# Altium project RTM_SFP.PrjPcb (part 2 of 2)

## Sheet Serial_Registers.SchDoc: Serial Registers
size 420 x 297 mm; Organization: Altium Limited; Address1: L3, 12a Rodborough Rd; Address2: Frenchs Forest; Address3: NSW; Address4: Australia 2086; SheetNumber: 6; SheetTotal: 8
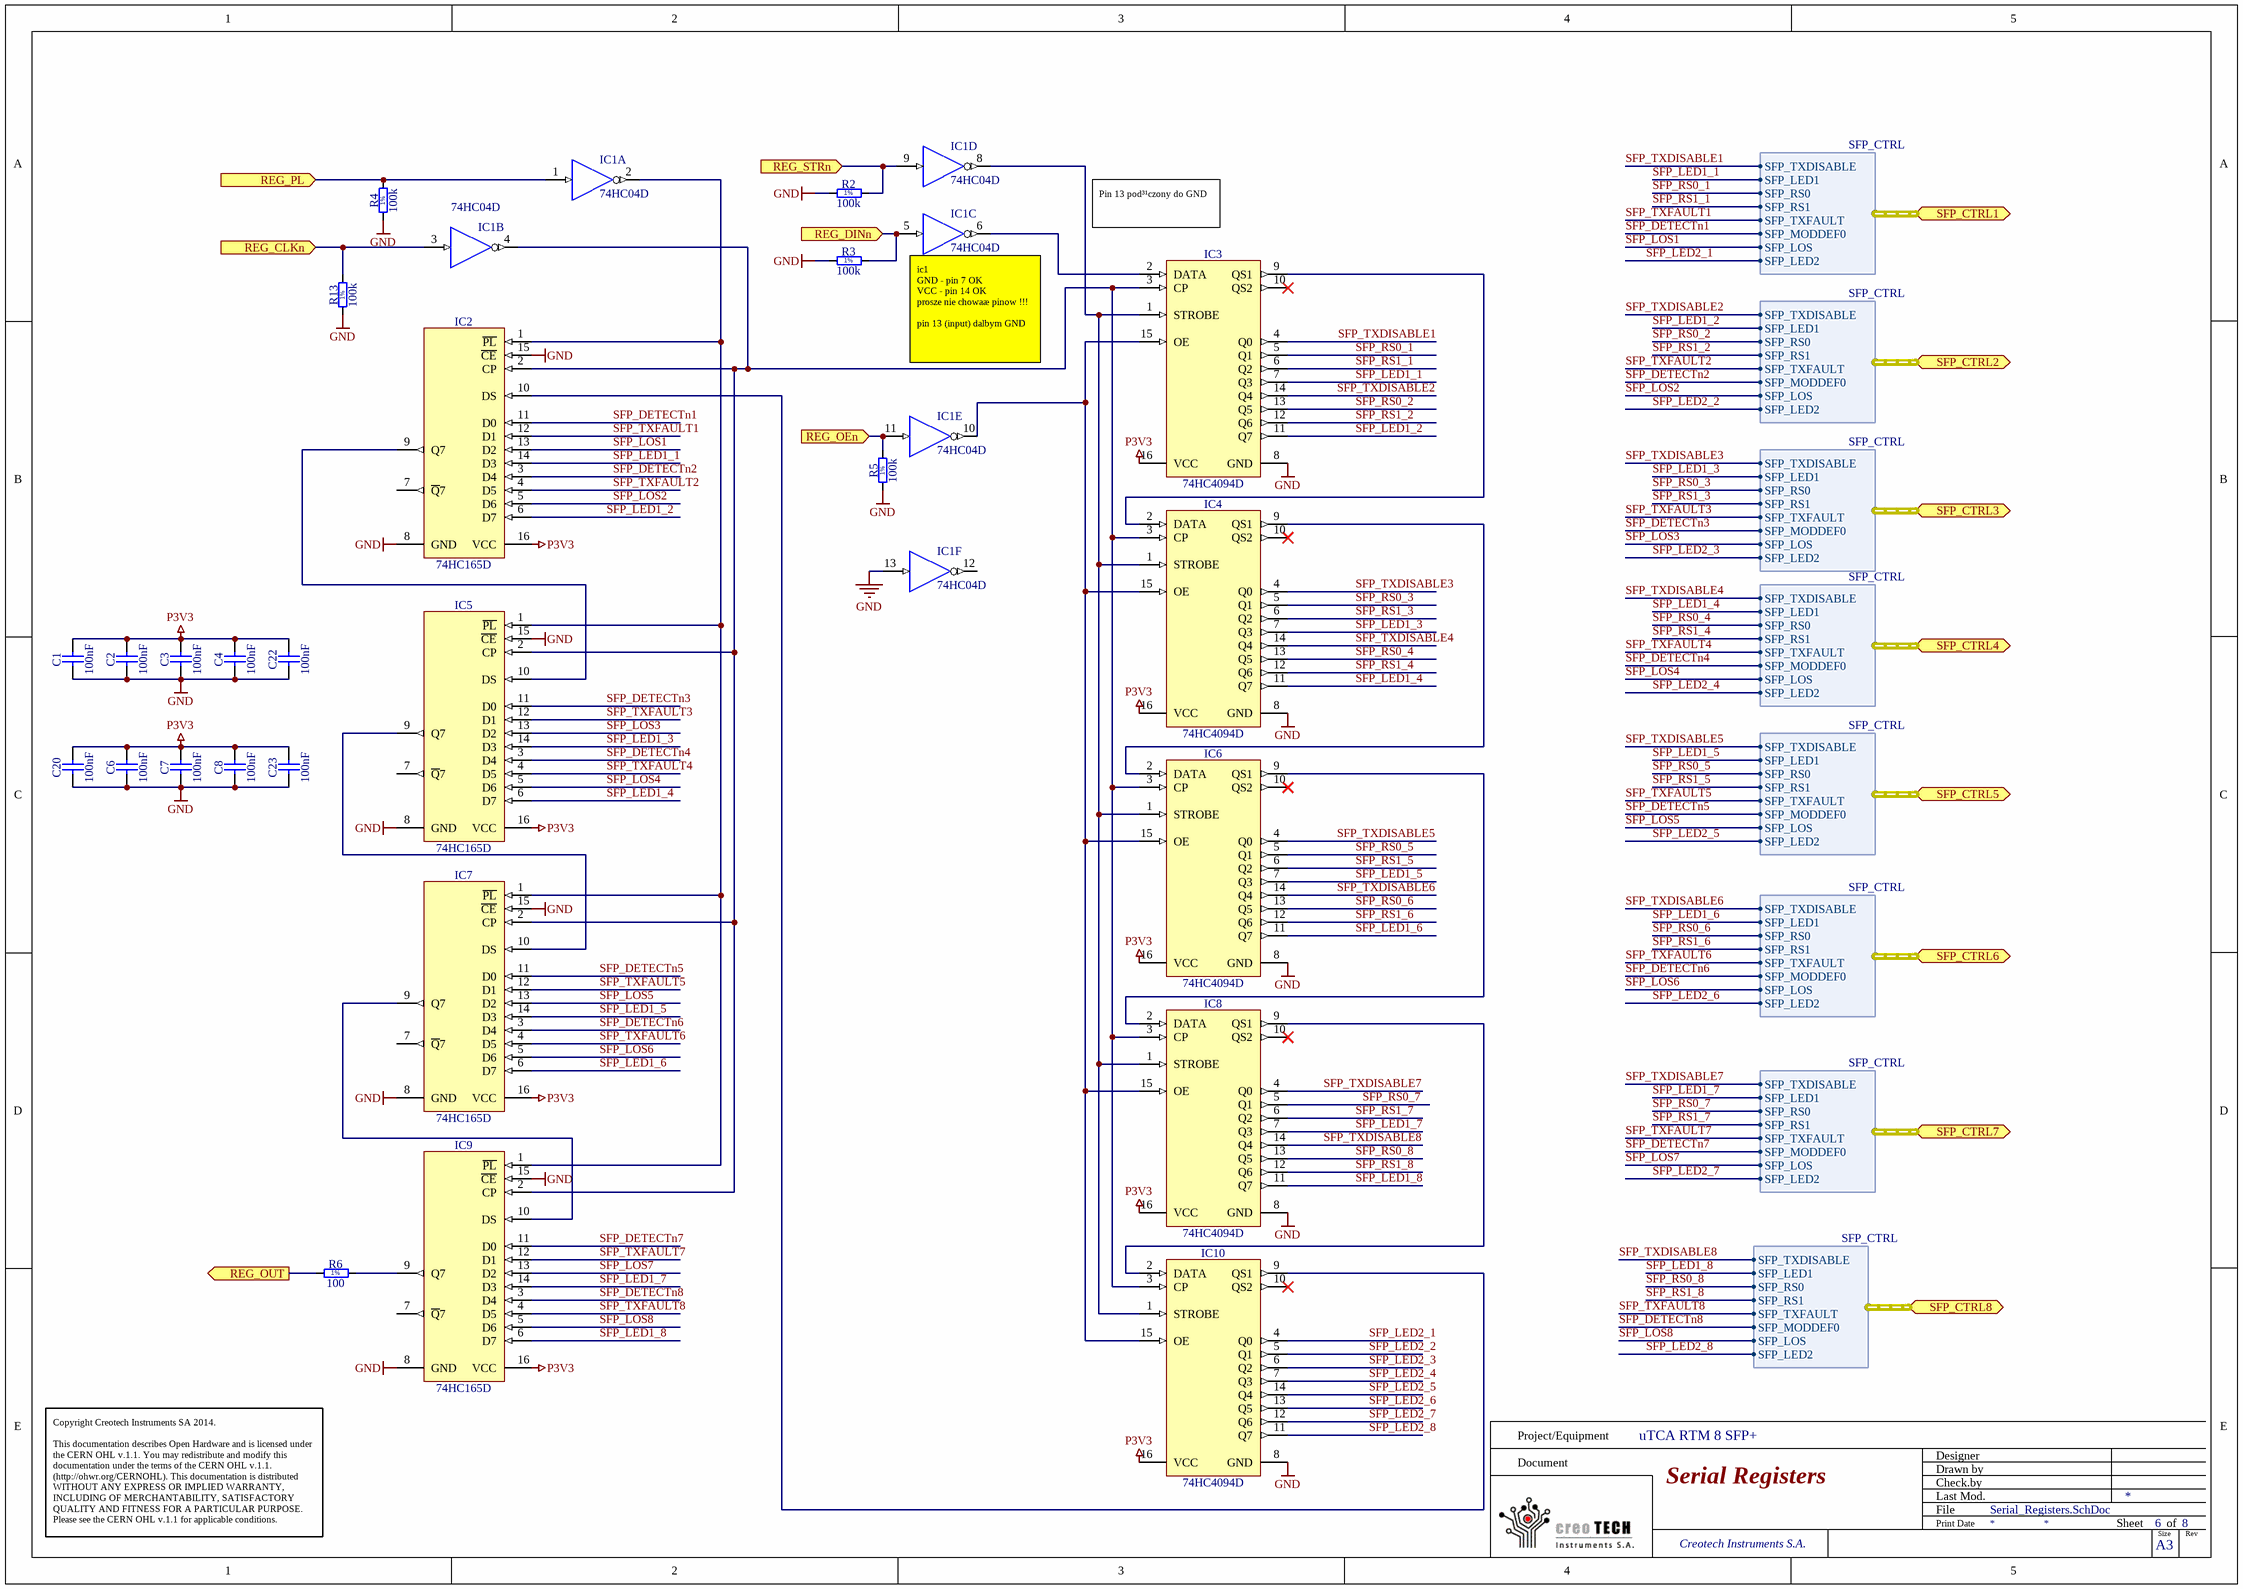
[diagram p4: Serial_Registers.SchDoc]

### Parts
C1  100nF  [CAPC1005X55N]
C2  100nF  [CAPC1005X55N]
C3  100nF  [CAPC1005X55N]
C4  100nF  [CAPC1005X55N]
C6  100nF  [CAPC1005X55N]
C7  100nF  [CAPC1005X55N]
C8  100nF  [CAPC1005X55N]
C20  100nF  [CAPC1005X55N]
C22  100nF  [CAPC1005X55N]
C23  100nF  [CAPC1005X55N]
IC1  74HC04D  [SOIC127P600X175-14N]  (parts A,B,C,D,E,F of 6)
IC2  74HC165D  [SOIC127P600X175-16N]
IC3  74HC4094D  [SOIC127P1000X400-16N]
IC4  74HC4094D  [SOIC127P1000X400-16N]
IC5  74HC165D  [SOIC127P600X175-16N]
IC6  74HC4094D  [SOIC127P1000X400-16N]
IC7  74HC165D  [SOIC127P600X175-16N]
IC8  74HC4094D  [SOIC127P1000X400-16N]
IC9  74HC165D  [SOIC127P600X175-16N]
IC10  74HC4094D  [SOIC127P1000X400-16N]
R2  100k  [RESC1608X55N]
R3  100k  [RESC1608X55N]
R4  100k  [RESC1608X55N]
R5  100k  [RESC1608X55N]
R6  100  [RESC1608X55N]
R13  100k  [RESC1608X55N]

### Ports
REG_CLKn (in), REG_DINn (in), REG_OEn (in), REG_OUT (out), REG_PL (in), REG_STRn (in), SFP_CTRL1 (harness SFP_CTRL), SFP_CTRL2 (harness SFP_CTRL), SFP_CTRL3 (harness SFP_CTRL), SFP_CTRL4 (harness SFP_CTRL), SFP_CTRL5 (harness SFP_CTRL), SFP_CTRL6 (harness SFP_CTRL), SFP_CTRL7 (harness SFP_CTRL), SFP_CTRL8 (harness SFP_CTRL)

### Harnesses
SFP_CTRL: SFP_LED1, SFP_TXFAULT, SFP_TXDISABLE, SFP_MODDEF0, SFP_RS0, SFP_RS1, SFP_LOS, SFP_LED2

### Nets
GND: C1.2 C2.2 C3.2 C4.2 C6.2 C7.2 C8.2 C20.2 C22.2 C23.2 IC1.7(GND) IC1.13(A) IC2.8(GND) IC2.15(~{CE}) IC3.8(GND) IC4.8(GND) IC5.8(GND) IC5.15(~{CE}) IC6.8(GND) IC7.8(GND) IC7.15(~{CE}) IC8.8(GND) IC9.8(GND) IC9.15(~{CE}) IC10.8(GND) R2.1 R3.1 R4.1 R5.1 R13.1
P3V3: C1.1 C2.1 C3.1 C4.1 C6.1 C7.1 C8.1 C20.1 C22.1 C23.1 IC1.14(VCC) IC2.16(VCC) IC3.16(VCC) IC4.16(VCC) IC5.16(VCC) IC6.16(VCC) IC7.16(VCC) IC8.16(VCC) IC9.16(VCC) IC10.16(VCC)
RTM_IO1: R6.1 ; port REG_OUT
RTM_IO2: IC1.11(A) R5.2 ; port REG_OEn
RTM_IO3: IC1.3(A) R13.2 ; port REG_CLKn
RTM_IO4: IC1.9(A) R2.2 ; port REG_STRn
RTM_IO5: IC1.5(A) R3.2 ; port REG_DINn
RTM_IO6: IC1.1(A) R4.2 ; port REG_PL
SFP_DETECTn1: IC2.11(D0) ; port SFP_CTRL1.SFP_MODDEF0
SFP_DETECTn2: IC2.3(D4) ; port SFP_CTRL2.SFP_MODDEF0
SFP_DETECTn3: IC5.11(D0) ; port SFP_CTRL3.SFP_MODDEF0
SFP_DETECTn4: IC5.3(D4) ; port SFP_CTRL4.SFP_MODDEF0
SFP_DETECTn5: IC7.11(D0) ; port SFP_CTRL5.SFP_MODDEF0
SFP_DETECTn6: IC7.3(D4) ; port SFP_CTRL6.SFP_MODDEF0
SFP_DETECTn7: IC9.11(D0) ; port SFP_CTRL7.SFP_MODDEF0
SFP_DETECTn8: IC9.3(D4) ; port SFP_CTRL8.SFP_MODDEF0
SFP_LED1_1: IC2.14(D3) IC3.7(Q3) ; port SFP_CTRL1.SFP_LED1
SFP_LED1_2: IC2.6(D7) IC3.11(Q7) ; port SFP_CTRL2.SFP_LED1
SFP_LED1_3: IC4.7(Q3) IC5.14(D3) ; port SFP_CTRL3.SFP_LED1
SFP_LED1_4: IC4.11(Q7) IC5.6(D7) ; port SFP_CTRL4.SFP_LED1
SFP_LED1_5: IC6.7(Q3) IC7.14(D3) ; port SFP_CTRL5.SFP_LED1
SFP_LED1_6: IC6.11(Q7) IC7.6(D7) ; port SFP_CTRL6.SFP_LED1
SFP_LED1_7: IC8.7(Q3) IC9.14(D3) ; port SFP_CTRL7.SFP_LED1
SFP_LED1_8: IC8.11(Q7) IC9.6(D7) ; port SFP_CTRL8.SFP_LED1
SFP_LED2_1: IC10.4(Q0) ; port SFP_CTRL1.SFP_LED2
SFP_LED2_2: IC10.5(Q1) ; port SFP_CTRL2.SFP_LED2
SFP_LED2_3: IC10.6(Q2) ; port SFP_CTRL3.SFP_LED2
SFP_LED2_4: IC10.7(Q3) ; port SFP_CTRL4.SFP_LED2
SFP_LED2_5: IC10.14(Q4) ; port SFP_CTRL5.SFP_LED2
SFP_LED2_6: IC10.13(Q5) ; port SFP_CTRL6.SFP_LED2
SFP_LED2_7: IC10.12(Q6) ; port SFP_CTRL7.SFP_LED2
SFP_LED2_8: IC10.11(Q7) ; port SFP_CTRL8.SFP_LED2
SFP_LOS1: IC2.13(D2) ; port SFP_CTRL1.SFP_LOS
SFP_LOS2: IC2.5(D6) ; port SFP_CTRL2.SFP_LOS
SFP_LOS3: IC5.13(D2) ; port SFP_CTRL3.SFP_LOS
SFP_LOS4: IC5.5(D6) ; port SFP_CTRL4.SFP_LOS
SFP_LOS5: IC7.13(D2) ; port SFP_CTRL5.SFP_LOS
SFP_LOS6: IC7.5(D6) ; port SFP_CTRL6.SFP_LOS
SFP_LOS7: IC9.13(D2) ; port SFP_CTRL7.SFP_LOS
SFP_LOS8: IC9.5(D6) ; port SFP_CTRL8.SFP_LOS
SFP_RS0_1: IC3.5(Q1) ; port SFP_CTRL1.SFP_RS0
SFP_RS0_2: IC3.13(Q5) ; port SFP_CTRL2.SFP_RS0
SFP_RS0_3: IC4.5(Q1) ; port SFP_CTRL3.SFP_RS0
SFP_RS0_4: IC4.13(Q5) ; port SFP_CTRL4.SFP_RS0
SFP_RS0_5: IC6.5(Q1) ; port SFP_CTRL5.SFP_RS0
SFP_RS0_6: IC6.13(Q5) ; port SFP_CTRL6.SFP_RS0
SFP_RS0_7: IC8.5(Q1) ; port SFP_CTRL7.SFP_RS0
SFP_RS0_8: IC8.13(Q5) ; port SFP_CTRL8.SFP_RS0
SFP_RS1_1: IC3.6(Q2) ; port SFP_CTRL1.SFP_RS1
SFP_RS1_2: IC3.12(Q6) ; port SFP_CTRL2.SFP_RS1
SFP_RS1_3: IC4.6(Q2) ; port SFP_CTRL3.SFP_RS1
SFP_RS1_4: IC4.12(Q6) ; port SFP_CTRL4.SFP_RS1
SFP_RS1_5: IC6.6(Q2) ; port SFP_CTRL5.SFP_RS1
SFP_RS1_6: IC6.12(Q6) ; port SFP_CTRL6.SFP_RS1
SFP_RS1_7: IC8.6(Q2) ; port SFP_CTRL7.SFP_RS1
SFP_RS1_8: IC8.12(Q6) ; port SFP_CTRL8.SFP_RS1
SFP_TXDISABLE1: IC3.4(Q0) ; port SFP_CTRL1.SFP_TXDISABLE
SFP_TXDISABLE2: IC3.14(Q4) ; port SFP_CTRL2.SFP_TXDISABLE
SFP_TXDISABLE3: IC4.4(Q0) ; port SFP_CTRL3.SFP_TXDISABLE
SFP_TXDISABLE4: IC4.14(Q4) ; port SFP_CTRL4.SFP_TXDISABLE
SFP_TXDISABLE5: IC6.4(Q0) ; port SFP_CTRL5.SFP_TXDISABLE
SFP_TXDISABLE6: IC6.14(Q4) ; port SFP_CTRL6.SFP_TXDISABLE
SFP_TXDISABLE7: IC8.4(Q0) ; port SFP_CTRL7.SFP_TXDISABLE
SFP_TXDISABLE8: IC8.14(Q4) ; port SFP_CTRL8.SFP_TXDISABLE
SFP_TXFAULT1: IC2.12(D1) ; port SFP_CTRL1.SFP_TXFAULT
SFP_TXFAULT2: IC2.4(D5) ; port SFP_CTRL2.SFP_TXFAULT
SFP_TXFAULT3: IC5.12(D1) ; port SFP_CTRL3.SFP_TXFAULT
SFP_TXFAULT4: IC5.4(D5) ; port SFP_CTRL4.SFP_TXFAULT
SFP_TXFAULT5: IC7.12(D1) ; port SFP_CTRL5.SFP_TXFAULT
SFP_TXFAULT6: IC7.4(D5) ; port SFP_CTRL6.SFP_TXFAULT
SFP_TXFAULT7: IC9.12(D1) ; port SFP_CTRL7.SFP_TXFAULT
SFP_TXFAULT8: IC9.4(D5) ; port SFP_CTRL8.SFP_TXFAULT
NetIC1_2: IC1.2(~{O}) IC2.1(~{PL}) IC5.1(~{PL}) IC7.1(~{PL}) IC9.1(~{PL})
NetIC1_4: IC1.4(~{O}) IC2.2(CP) IC3.3(CP) IC4.3(CP) IC5.2(CP) IC6.3(CP) IC7.2(CP) IC8.3(CP) IC9.2(CP) IC10.3(CP)
NetIC1_6: IC1.6(~{O}) IC3.2(DATA)
NetIC1_8: IC1.8(~{O}) IC3.1(STROBE) IC4.1(STROBE) IC6.1(STROBE) IC8.1(STROBE) IC10.1(STROBE)
NetIC1_10: IC1.10(~{O}) IC3.15(OE) IC4.15(OE) IC6.15(OE) IC8.15(OE) IC10.15(OE)
NetIC2_9: IC2.9(Q7) IC5.10(DS)
NetIC2_10: IC2.10(DS) IC10.9(QS1)
NetIC3_9: IC3.9(QS1) IC4.2(DATA)
NetIC4_9: IC4.9(QS1) IC6.2(DATA)
NetIC5_9: IC5.9(Q7) IC7.10(DS)
NetIC6_9: IC6.9(QS1) IC8.2(DATA)
NetIC7_9: IC7.9(Q7) IC9.10(DS)
NetIC8_9: IC8.9(QS1) IC10.2(DATA)
NetIC9_9: IC9.9(Q7) R6.2

Not connected (* = marked no-connect by the designer): IC1 12(~{O}); IC2 7(~{Q}7); IC3 10(QS2)*; IC4 10(QS2)*; IC5 7(~{Q}7); IC6 10(QS2)*; IC7 7(~{Q}7); IC8 10(QS2)*; IC9 7(~{Q}7); IC10 10(QS2)*

### Notes on the sheet
- (near IC3) Pin 13 pod³¹czony do GND
- (near IC1) ic1
  GND - pin 7 OK
  VCC - pin 14 OK
  prosze nie chowaæ pinow !!!
  pin 13 (input) dalbym GND
- Project/Equipment
- Document
- uTCA RTM 8 SFP+
- Designer
- Drawn by
- Check.by
- Copyright Creotech Instruments SA 2014.
  This documentation describes Open Hardware and is licensed under the CERN OHL v.1.1. You may redistribute and modify this documentation under the terms of the CERN OHL v.1.1. (http://ohwr.org/CERNOHL). This documentation is distributed WITHOUT ANY EXPRESS OR IMPLIED WARRANTY, INCLUDING OF MERCHANTABILITY, SATISFACTORY QUALITY AND FITNESS FOR A PARTICULAR PURPOSE. Please see the CERN OHL v.1.1 for applicable conditions.
- Creotech Instruments S.A.
- File
- Last Mod.
- Print Date
- Sheet
- Size
- A3
- of
- Rev
- (in symbol R0603_100K_1%_0.1W_100PPM) 1%
- (in symbol R0603_100R_1%_0.1W_100PPM) 1%

### Library data of the parts
C1-C4 C6-C8 C20 C22 C23 = CC0402_100NF_16V_10%_X7R: Non-polarised capacitor; Part Description: SMD Multilayer Chip Ceramic Capacitor; Manufacturer: GENERIC; Manufacturer1 Part Number: 223878715649; Voltage: 16V; TC: X7R; Tolerance: ±10%; Table: Capacitors SMD; Part Number: CC0402_100NF_16V_10%_X7R; Component Kind: Standard; Component Type: Standard; Pin Count: 2; Value: 100nF; Status: Not Recommended; Manufacturer Part Number: CC0402_100NF_16V_10%_X7R; Case: 0402; Mounted: Yes; Socket: No; SMD: Yes; Manufacturer1 Example: PHYCOMP; Manufacturer1 ComponentHeight: 0.55mm; HelpURL: \\cern.ch\dfs\Applications\Altium\Datasheets\CC0402_X7R_PHYCOMP.pdf; Author: CERN DEM JLC; CreateDate: 12/3/2007; LatestRevisionDate: 12/3/2007
IC1 = 74HC04D: Hex Inverter; Part Description: Hex Inverters; Manufacturer: NXP SEMICONDUCTORS; Table: Standard Logic; Part Number: 74HC04D; Component Kind: Standard; Component Type: Standard; Device: 74HC04D; PackageDescription: SOIC 14, Pitch 1.27mm - Body 4x8.75mm, IPC Medium Density; Manufacturer Part Number: 74HC04D; Pin Count: 12; Case: SOIC14; Mounted: Yes; Socket: No; SMD: Yes; ComponentHeight: 1.75mm; Author: CERN DEM JLC; HelpURL: \\cern.ch\dfs\Applications\Altium\Datasheets\74HC04D.pdf; CreateDate: 2011-04-06; LatestRevisionDate: 2011-04-06
IC2 IC5 IC7 IC9 = 74HC165D: 8-Bit Parallel-In/Serial Out Shift Register; Manufacturer: NXP SEMICONDUCTORS; Table: Standard Logic; Part Number: 74HC165D; Component Kind: Standard; Component Type: Standard; Device: 74HC165D; PackageDescription: SOIC 16, Pitch 1.27mm - Body 4x10mm, IPC Medium Density; Part Description: 8-Bit Parallel-In/Serial Out Shift Register; Manufacturer Part Number: 74HC165D; Pin Count: 16; Case: SOIC16; Mounted: Yes; Socket: No; SMD: Yes; ComponentHeight: 1.75mm; Author: CERN DEM JLC; HelpURL: \\cern.ch\dfs\Applications\Altium\Datasheets\74HC165D.pdf; CreateDate: 2012-04-26; LatestRevisionDate: 2012-04-26
IC3 IC4 IC6 IC8 IC10 = 74HC4094D: High−Speed CMOS Logic, 8−Stage Shift and Store Bus Register, Three−State; Manufacturer: NXP; PressFit: No; Bonding: No; Part Number: 74HC4094D; Component Kind: Standard; Component Type: Standard; Device: 74HC4094D; PackageDescription: SOIC 16, Pitch 1.27mm - Body 4x10mm, IPC Medium Density; Part Description: High−Speed CMOS Logic, 8−Stage Shift and Store Bus Register, Three−State; Manufacturer Part Number: 74HC4094D; Pin Count: 16; Case: SOIC16; Mounted: Yes; Socket: No; SMD: Yes; Sense: No; ComponentHeight: 1.75mm; Author: LNLS DIG LOS; CreateDate: 27/01/2017; LatestRevisionDate: 27/01/2017
R2-R5 R13 = R0603_100K_1%_0.1W_100PPM: Resistor - 1%; Part Description: General Purpose Thick Film Chip Resistor; Manufacturer: GENERIC; Manufacturer1 Part Number: NRC06F1003TRF; Power: 0.1W; TC: ±100ppm/°C; Part Number: R0603_100K_1%_0.1W_100PPM; Component Kind: Standard; Component Type: Standard; Pin Count: 2; Value: 100k; Status: Preferred; Tolerance: ±1%; Manufacturer Part Number: R0603_100K_1%_0.1W_100PPM; Case: 0603; Mounted: Yes; Sense: No; Socket: No; SMD: Yes; Manufacturer1 Example: NIC COMPONENT; Manufacturer1 ComponentHeight: 0.55mm; HelpURL: \\cern.ch\dfs\Applications\Altium\Datasheets\R0603_NIC_NRC.pdf; Author: CERN DEM JLC; CreateDate: 03/12/2007; LatestRevisionDate: 13/03/2008
R6 = R0603_100R_1%_0.1W_100PPM: as R33 on sheet RTM_Connectors; Part Number: R0603_100R_1%_0.1W_100PPM; Component Kind: Standard; Component Type: Standard; Pin Count: 2; Value: 100; Status: Preferred; Tolerance: ±1%; Manufacturer Part Number: R0603_100R_1%_0.1W_100PPM; Case: 0603; Mounted: Yes; Sense: No; Socket: No; SMD: Yes; Manufacturer1 Example: NIC COMPONENT; Manufacturer1 ComponentHeight: 0.55mm; HelpURL: \\cern.ch\dfs\Applications\Altium\Datasheets\R0603_NIC_NRC.pdf; Author: CERN DEM JLC; CreateDate: 03/12/2007; LatestRevisionDate: 13/03/2008

## Sheet SFP.SchDoc: SFP
size 420 x 297 mm; Organization: Altium Limited; Address1: L3, 12a Rodborough Rd; Address2: Frenchs Forest; Address3: NSW; Address4: Australia 2086; SheetNumber: 7; SheetTotal: 8
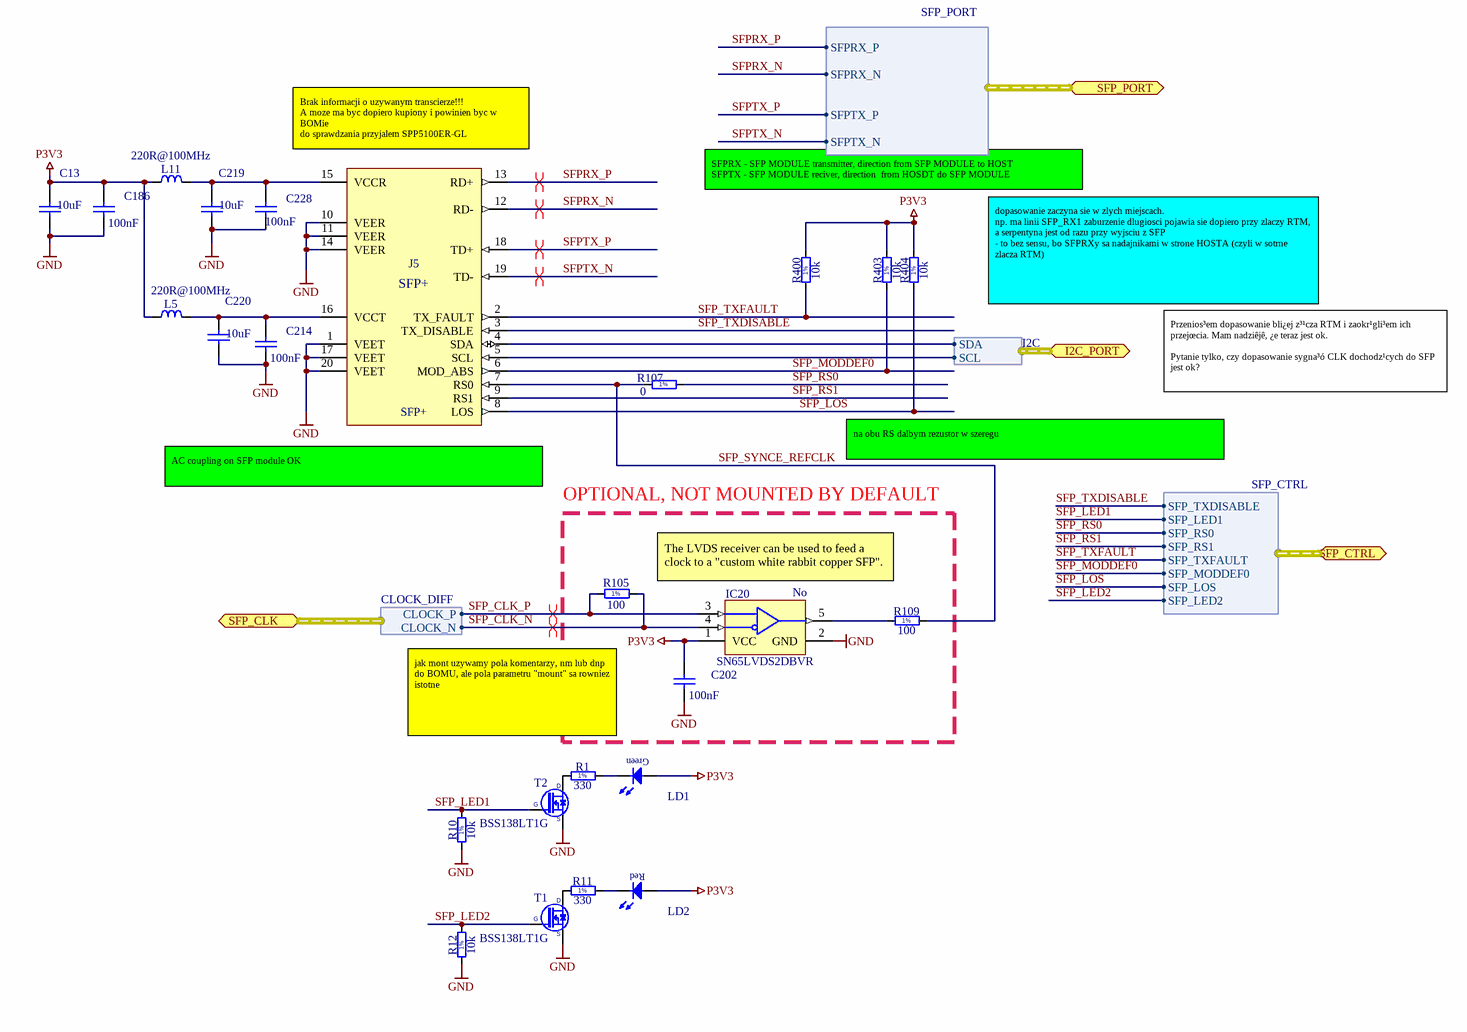
[diagram p5: SFP.SchDoc]

### Parts
C13  10uF  [CAPC2012X135N]
C186  100nF  [CAPC1005X55N]
C202  100nF  [CAPC1005X55N]
C214  100nF  [CAPC1005X55N]
C219  10uF  [CAPC2012X135N]
C220  10uF  [CAPC2012X135N]
C228  100nF  [CAPC1005X55N]
IC20  SN65LVDS2DBVR  Mounted: No  [SOT95P280X145-5N]
J5  SFP+  [TYCO_1888247-1]
L5  220R@100MHz  [INDC2012X105N]
L11  220R@100MHz  [INDC2012X105N]
LD1  Green  [LED_AVAGO_HSME-C120]  (value not drawn)
LD2  Red  [LED_AVAGO_HSMC-C120]  (value not drawn)
R1  330  [RESC1608X55N]
R10  10k  [RESC1005X40N]
R11  330  [RESC1608X55N]
R12  10k  [RESC1005X40N]
R105  100  [RESC1608X55N]
R107  0  [RESC1608X55N]
R109  100  [RESC1608X55N]
R400  10k  [RESC1005X40N]
R403  10k  [RESC1005X40N]
R404  10k  [RESC1005X40N]
T1  BSS138LT1G  [SOT95P240X110-3N]
T2  BSS138LT1G  [SOT95P240X110-3N]

### Blocks framed on the sheet
OPTIONAL, NOT MOUNTED BY DEFAULT: C202 IC20 R105 R109

### Ports
I2C_PORT (harness I2C), SFP_CLK (harness CLOCK_DIFF), SFP_CTRL (harness SFP_CTRL), SFP_PORT (harness SFP_PORT)

### Harnesses
I2C: SCL, SDA
CLOCK_DIFF: CLOCK_P, CLOCK_N
SFP_PORT: SFPRX_P, SFPRX_N, SFPTX_P, SFPTX_N
SFP_CTRL: SFP_LED1, SFP_TXFAULT, SFP_TXDISABLE, SFP_MODDEF0, SFP_RS0, SFP_RS1, SFP_LOS, SFP_LED2

### Nets
GND: C13.2 C186.2 C202.1 C214.2 C219.2 C220.2 C228.2 IC20.2(GND) J5.1(VEET) J5.10(VEER) J5.11(VEER) J5.14(VEER) J5.17(VEET) J5.20(VEET) R10.1 R12.1 T1.2(S) T2.2(S)
P3V3: C13.1 C186.1 C202.2 IC20.1(VCC) L5.1 L11.1 LD1.2(A) LD2.2(A) R400.2 R403.2 R404.2
SFP_CLK_N: IC20.4(B) R105.2 ; port SFP_CLK.CLOCK_N
SFP_CLK_P: IC20.3(A) R105.1 ; port SFP_CLK.CLOCK_P
SFP_LED1: R10.2 T2.1(G) ; port SFP_CTRL.SFP_LED1
SFP_LED2: R12.2 T1.1(G) ; port SFP_CTRL.SFP_LED2
SFP_LOS: J5.8(LOS) R404.1 ; port SFP_CTRL.SFP_LOS
SFP_MODDEF0: J5.6(MOD_ABS) R403.1 ; port SFP_CTRL.SFP_MODDEF0
SFP_RS0: R107.2 ; port SFP_CTRL.SFP_RS0
SFP_RS1: J5.9(RS1) ; port SFP_CTRL.SFP_RS1
SFP_SYNCE_REFCLK: J5.7(RS0) R107.1 R109.2
SFP_TXDISABLE: J5.3(TX_DISABLE) ; port SFP_CTRL.SFP_TXDISABLE
SFP_TXFAULT: J5.2(TX_FAULT) R400.1 ; port SFP_CTRL.SFP_TXFAULT
SFPRX_N: J5.12(RD-) ; port SFP_PORT.SFPRX_N
SFPRX_P: J5.13(RD+) ; port SFP_PORT.SFPRX_P
SFPTX_N: J5.19(TD-) ; port SFP_PORT.SFPTX_N
SFPTX_P: J5.18(TD+) ; port SFP_PORT.SFPTX_P
NetC214_1: C214.1 C220.1 J5.16(VCCT) L5.2
NetC219_1: C219.1 C228.1 J5.15(VCCR) L11.2
NetIC20_5: IC20.5(R) R109.1
NetJ5_4: J5.4(SDA) ; port I2C_PORT.SDA
NetJ5_5: J5.5(SCL) ; port I2C_PORT.SCL
NetLD1_1: LD1.1(C) R1.2
NetLD2_1: LD2.1(C) R11.2
NetR1_1: R1.1 T2.3(D)
NetR11_1: R11.1 T1.3(D)

### Layout directives
differential pair: SFP_CLK_N, SFP_CLK_P, SFPRX_N, SFPRX_P, SFPTX_N, SFPTX_P

### Notes on the sheet
- (near J5) Brak informacji o uzywanym transcierze!!!
  A moze ma byc dopiero kupiony i powinien byc w BOMie
  do sprawdzania przyjalem SPP5100ER-GL
- SFPRX - SFP MODULE transmitter, direction from SFP MODULE to HOST
  SFPTX - SFP MODULE reciver, direction  from HOSDT do SFP MODULE
- dopasowanie zaczyna sie w zlych miejscach.
  np. ma linii SFP_RX1 zaburzenie dlugiosci pojawia sie dopiero przy zlaczy RTM, a serpentyna jest od razu przy wyjsciu z SFP
  - to bez sensu, bo SFPRXy sa nadajnikami w strone HOSTA (czyli w sotrne zlacza RTM)
- Przenios³em dopasowanie bli¿ej z³¹cza RTM i zaokr¹gli³em ich przejœcia. Mam nadziêjê, ¿e teraz jest ok.
  Pytanie tylko, czy dopasowanie sygna³ó CLK dochodz¹cych do SFP jest ok?
- (near J5) AC coupling on SFP module OK
- na obu RS dalbym rezustor w szeregu
- The LVDS receiver can be used to feed a clock to a "custom white rabbit copper SFP".
- jak mont uzywamy pola komentarzy, nm lub dnp do BOMU, ale pola parametru "mount" sa rowniez istotne
- Project/Equipment
- Document
- uTCA RTM 8 SFP+
- Designer
- Drawn by
- Check.by
- Copyright Creotech Instruments SA 2014.
  This documentation describes Open Hardware and is licensed under the CERN OHL v.1.1. You may redistribute and modify this documentation under the terms of the CERN OHL v.1.1. (http://ohwr.org/CERNOHL). This documentation is distributed WITHOUT ANY EXPRESS OR IMPLIED WARRANTY, INCLUDING OF MERCHANTABILITY, SATISFACTORY QUALITY AND FITNESS FOR A PARTICULAR PURPOSE. Please see the CERN OHL v.1.1 for applicable conditions.
- Creotech Instruments S.A.
- File
- Last Mod.
- Print Date
- Sheet
- Size
- A3
- of
- Rev
- (in symbol R0402_10K_1%_0.0625W_100PPM) 1%
- (in symbol R0603_0R_JUMPER) 1%
- (in symbol R0603_100R_1%_0.1W_100PPM) 1%
- (in symbol R0603_330R_1%_0.1W_100PPM) 1%

### Library data of the parts
C13 C219 C220 = CC0805_10UF_10V_10%_X7R: Non-polarised capacitor; Part Description: SMD Multilayer Chip Ceramic Capacitor; Manufacturer: GENERIC; Manufacturer1 Part Number: GRM21BR71A106KE51L; Voltage: 10V; TC: X7R; Tolerance: ±10%; Table: Capacitors SMD; Part Number: CC0805_10UF_10V_10%_X7R; Component Kind: Standard; Component Type: Standard; Pin Count: 2; Value: 10uF; Status: Preferred; Manufacturer Part Number: CC0805_10UF_10V_10%_X7R; Case: 0805; Mounted: Yes; Socket: No; SMD: Yes; Manufacturer1 Example: MURATA; Manufacturer1 ComponentHeight: 1.35mm; HelpURL: \\cern.ch\dfs\Applications\Altium\Datasheets\CC0805_X7R_MURATA.pdf; Author: CERN DEM JLC; CreateDate: 2012-04-30; LatestRevisionDate: 2012-04-30
C186 C214 C228 = CC0402_100NF_16V_10%_X7R: as C1 on sheet Serial_Registers; Part Number: CC0402_100NF_16V_10%_X7R; Component Kind: Standard; Component Type: Standard; Pin Count: 2; Value: 100nF; Status: Not Recommended; Manufacturer Part Number: CC0402_100NF_16V_10%_X7R; Case: 0402; Mounted: Yes; Socket: No; SMD: Yes; Manufacturer1 Example: PHYCOMP; Manufacturer1 ComponentHeight: 0.55mm; HelpURL: \\cern.ch\dfs\Applications\Altium\Datasheets\CC0402_X7R_PHYCOMP.pdf; Author: CERN DEM JLC; CreateDate: 12/3/2007; LatestRevisionDate: 12/3/2007
C202 = CC0402_100NF_16V_10%_X7R: Non-polarised capacitor; Part Description: SMD Multilayer Chip Ceramic Capacitor; Manufacturer: GENERIC; Manufacturer1 Part Number: 223878715649; Voltage: 16V; TC: X7R; Tolerance: ±10%; Mounted: No; Table: Capacitors SMD; Part Number: CC0402_100NF_16V_10%_X7R; Component Kind: Standard; Component Type: Standard; Pin Count: 2; Value: 100nF; Status: Not Recommended; Manufacturer Part Number: CC0402_100NF_16V_10%_X7R; Case: 0402; Socket: No; SMD: Yes; Manufacturer1 Example: PHYCOMP; Manufacturer1 ComponentHeight: 0.55mm; HelpURL: \\cern.ch\dfs\Applications\Altium\Datasheets\CC0402_X7R_PHYCOMP.pdf; Author: CERN DEM JLC; CreateDate: 2007-12-03; LatestRevisionDate: 2007-12-03
IC20 = SN65LVDS2DBVR: High-Speed Differential Line Receiver; Manufacturer: TEXAS INSTRUMENTS; Table: Analog & Interface; Part Number: SN65LVDS2DBVR; Component Kind: Standard; Component Type: Standard; Device: SN65LVDS2DBVR; PackageDescription: SOT, 0.95mm pitch; 5 pin, 1.60mm W X 2.90mm L X 1.45mm H body, IPC Medium Density; Part Description: High-Speed Differential Line Receiver; Manufacturer Part Number: SN65LVDS2DBVR; Pin Count: 5; Case: SOT23-5; Socket: No; SMD: Yes; ComponentHeight: 1.45mm; Author: CERN DEM JLC; HelpURL: \\cern.ch\dfs\Applications\Altium\Datasheets\SN65LVDS2DBVR.pdf; CreateDate: 3/3/2011; LatestRevisionDate: 3/3/2011
J5 = TYCO_1888247-1: 20 Position SFP+ Connector (Small Form-factor Pluggable); Part Description: 20 Position, Pitch 0.8mm SFP+  Receptacle (Small Form-factor Pluggable); Manufacturer: TYCO ELECTRONICS; Table: TYCO; Part Number: TYCO_1888247-1; Component Kind: Standard; Component Type: Standard; Pin Count: 20; Family: SFP+; Mounted: Yes; Socket: No; SMD: Yes; Status: None; Manufacturer Part Number: 1888247-1; ComponentHeight: 5.4mm; HelpURL: \\cern.ch\dfs\Applications\Altium\Datasheets\TYCO_1888247-1.pdf; Author: CERN DEM JLC; CreateDate: 2012-02-27; LatestRevisionDate: 2012-02-27
L5 L11 = IND0805_MURATA_BLM21PG221SN1D: Inductor; Part Description: SMD EMIFIL Suppression Chip Ferrite Bead; Manufacturer: MURATA; Power: 2A; Resistance: 0.05R; Tolerance: ±25%; Table: Inductors SMD; Part Number: IND0805_MURATA_BLM21PG221SN1D; Component Kind: Standard; Component Type: Standard; Pin Count: 2; Value: 220R@100MHz; Status: None; Manufacturer Part Number: BLM21PG221SN1D; Case: 0805; Mounted: Yes; Socket: No; SMD: Yes; ComponentHeight: 1.05mm; HelpURL: \\cern.ch\dfs\Applications\Altium\Datasheets\IND0402_MURATA_BLM21P.pdf; Author: CERN DEM JLC; CreateDate: 25/01/2010; LatestRevisionDate: 25/01/2010
LD1 = LED_AVAGO_HSME-C120: LED Green 1C 2A; Part Description: High Performance Right Angle Chip Green LED; Manufacturer: AVAGO TECHNOLOGIES; PressFit: No; Bonding: No; Part Number: LED_AVAGO_HSME-C120; Component Kind: Standard; Component Type: Standard; Color: Green; PackageDescription: Green Chip LED, 2-Leads, Body 1.7x1.1mm, Side Emitting Package; Manufacturer Part Number: HSME-C120; Pin Count: 2; Mounted: Yes; Socket: No; SMD: Yes; Sense: No; ComponentHeight: 0.7mm; HelpURL: \\cern.ch\dfs\Applications\Altium\Datasheets\LED_AVAGO_HSME-C120.pdf; ComponentLink1URL: \\cern.ch\dfs\Applications\Altium\Datasheets\LED_AVAGO_HSME-C110_DESIGN-GUIDE.pdf; ComponentLink1Description: Design Guide; Author: CERN DEM JMW; CreateDate: 22/07/2009; LatestRevisionDate: 20/06/2012
LD2 = LED_AVAGO_HSMC-C120: LED Red 1C 2A; Part Description: High Performance Right Angle Chip Red LED; Manufacturer: AVAGO TECHNOLOGIES; PressFit: No; Bonding: No; Part Number: LED_AVAGO_HSMC-C120; Component Kind: Standard; Component Type: Standard; Color: Red; PackageDescription: Red Chip LED, 2-Leads, Body 1.7x1.1mm, Side Emitting Package; Manufacturer Part Number: HSMC-C120; Pin Count: 2; Mounted: Yes; Socket: No; SMD: Yes; Sense: No; ComponentHeight: 0.7mm; HelpURL: \\cern.ch\dfs\Applications\Altium\Datasheets\LED_AVAGO_HSMC-C120.pdf; ComponentLink1URL: \\cern.ch\dfs\Applications\Altium\Datasheets\LED_AVAGO_HSMC-C120_DESIGN-GUIDE.pdf; ComponentLink1Description: Design Guide; Author: CERN DEM JMW; CreateDate: 22/07/2009; LatestRevisionDate: 20/06/2012
R1 R11 = R0603_330R_1%_0.1W_100PPM: Resistor - 1%; Part Description: General Purpose Thick Film Chip Resistor; Manufacturer: GENERIC; Manufacturer1 Part Number: NRC06F3300TRF; Power: 0.1W; TC: ±100ppm/°C; Table: Resistors SMD; Part Number: R0603_330R_1%_0.1W_100PPM; Component Kind: Standard; Component Type: Standard; Pin Count: 2; Value: 330; Status: Preferred; Tolerance: ±1%; Manufacturer Part Number: R0603_330R_1%_0.1W_100PPM; Case: 0603; Mounted: Yes; Socket: No; SMD: Yes; Manufacturer1 Example: NIC COMPONENT; Manufacturer1 ComponentHeight: 0.55mm; HelpURL: \\cern.ch\dfs\Applications\Altium\Datasheets\R0603_NIC_NRC.pdf; Author: CERN DEM JLC; CreateDate: 2007-12-03; LatestRevisionDate: 2008-03-13
R10 R12 R400 R403 R404 = R0402_10K_1%_0.0625W_100PPM: Resistor - 1%; Part Description: General Purpose Thick Film Chip Resistor; Manufacturer: GENERIC; Manufacturer1 Part Number: 232270671003L; TC: ±100ppm/°C; Part Number: R0402_10K_1%_0.0625W_100PPM; Component Kind: Standard; Component Type: Standard; Pin Count: 2; Value: 10k; Status: Not recommended; Power: 0.0625W; Tolerance: ±1%; Manufacturer Part Number: R0402_10K_1%_0.0625W_100PPM; Case: 0402; Mounted: Yes; Socket: No; SMD: Yes; Manufacturer1 Example: YAGEO PHYCOMP; Manufacturer1 ComponentHeight: 0.4mm; HelpURL: \\cern.ch\dfs\Applications\Altium\Datasheets\R0402_Phycomp_RC0402.pdf; Author: CERN DEM JLC; CreateDate: 03/12/2007; LatestRevisionDate: 17/10/2012; Sense: No
R105 R109 = R0603_100R_1%_0.1W_100PPM: Resistor - 1%; Part Description: General Purpose Thick Film Chip Resistor; Manufacturer: GENERIC; Manufacturer1 Part Number: NRC06F4700TRF; Power: 0.1W; TC: ±100ppm/°C; Table: Resistors SMD; Part Number: R0603_100R_1%_0.1W_100PPM; Component Kind: Standard; Component Type: Standard; Pin Count: 2; Value: 100; Status: Preferred; Tolerance: ±1%; Manufacturer Part Number: R0603_100R_1%_0.1W_100PPM; Case: 0603; Socket: No; SMD: Yes; Manufacturer1 Example: NIC COMPONENT; Manufacturer1 ComponentHeight: 0.55mm; HelpURL: \\cern.ch\dfs\Applications\Altium\Datasheets\R0603_NIC_NRC.pdf; Author: CERN DEM JLC; CreateDate: 12/3/2007; LatestRevisionDate: 3/13/2008
R107 = R0603_0R_JUMPER: Resistor - 1%; Part Description: 1A (0.05R Max DC Resistance) Zero Ohm Jumper; Manufacturer: GENERIC; Manufacturer1 Part Number: NRC06Z0; Table: Resistors SMD; Part Number: R0603_0R_JUMPER; Component Kind: Standard; Component Type: Standard; Pin Count: 2; Value: 0; Status: Preferred; Manufacturer Part Number: R0603_0R_JUMPER; Case: 0603; Mounted: Yes; Socket: No; SMD: Yes; Manufacturer1 Example: NIC COMPONENT; Manufacturer1 ComponentHeight: 0.55mm; HelpURL: \\cern.ch\dfs\Applications\Altium\Datasheets\R0603_NIC_NRC.pdf; Author: CERN DEM JLC; CreateDate: 12/3/2007; LatestRevisionDate: 3/13/2008
T1 T2 = BSS138LT1G: N-CHANNEL MOSFET WITH DIODE; Part Description: 50V 200mA N-Channel Enhancement Mode Field-Effect Transistor; Manufacturer: ON SEMICONDUCTOR; Table: Transistors; Part Number: BSS138LT1G; Component Kind: Standard; Component Type: Standard; Device: BSS138LT1G; PackageDescription: SOT23 3-Leads, Pitch 0.95mm - Body 1.4x3mm, IPC Medium Density; Manufacturer Part Number: BSS138LT1G; Pin Count: 3; Case: SOT23-3; Mounted: Yes; Socket: No; SMD: Yes; ComponentHeight: 1.11mm; HelpURL: \\cern.ch\dfs\Applications\Altium\Datasheets\BSS138LT1G.pdf; Author: CERN DEM JLC; CreateDate: 2009-03-23; LatestRevisionDate: 2009-03-23

## Sheet USR_IO_IPMI.SchDoc: USER IO IPMI
size 420 x 297 mm; Organization: Altium Limited; Address1: L3, 12a Rodborough Rd; Address2: Frenchs Forest; Address3: NSW; Address4: Australia 2086; SheetNumber: 8; SheetTotal: 8
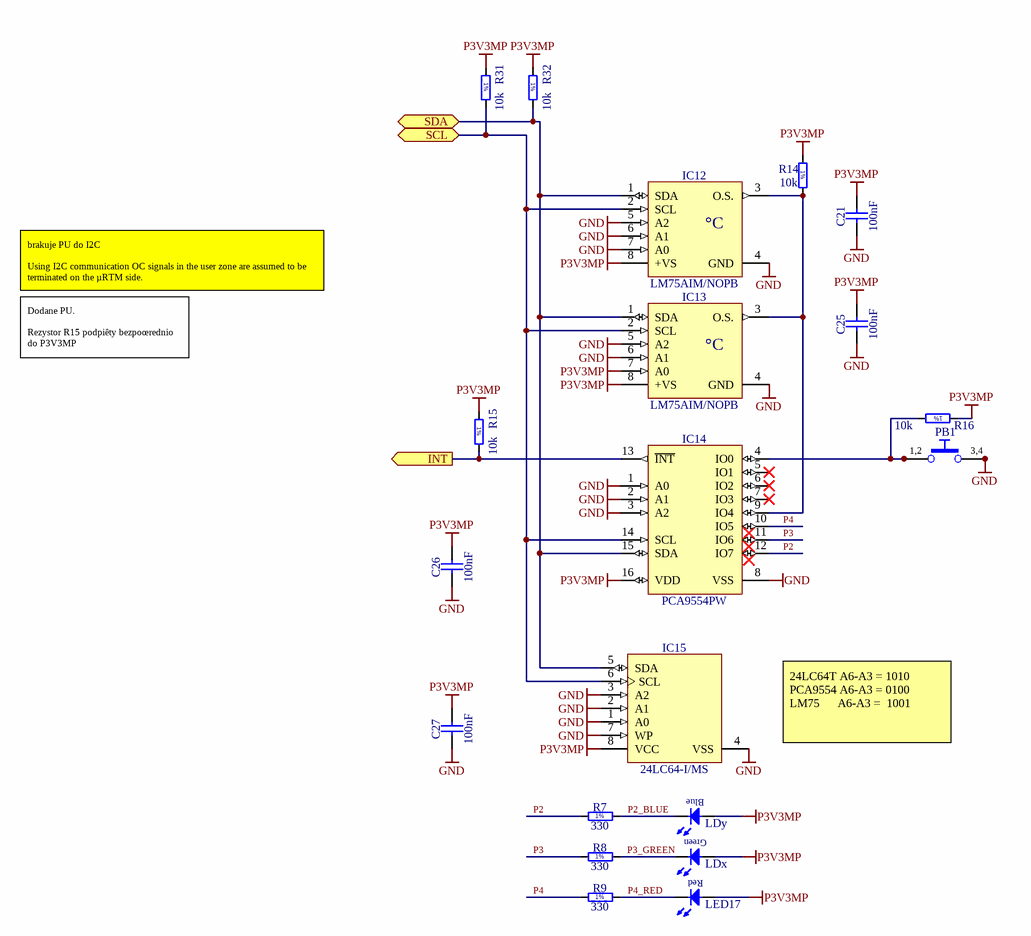
[diagram p6: USR_IO_IPMI.SchDoc]

### Parts
C21  100nF  [CAPC1005X55N]
C25  100nF  [CAPC1005X55N]
C26  100nF  [CAPC1005X55N]
C27  100nF  [CAPC1005X55N]
IC12  LM75AIM/NOPB  [SOIC127P600X175-8N]
IC13  LM75AIM/NOPB  [SOIC127P600X175-8N]
IC14  PCA9554PW  [SOP65P640X110-16N]
IC15  24LC64-I/MS  [SOP65P490X110-8N]
LDx  Green  [LED_AVAGO_HSME-C120]  (value not drawn)
LDy  Blue  [LED_AVAGO_HSMR-C120]  (value not drawn)
LED17  Red  [LEDC1608X80N_RED]  (value not drawn)
PB1  Push Button  [SW_C&K_HDT0001]  (value not drawn)
R7  330  [RESC1608X55N]
R8  330  [RESC1608X55N]
R9  330  [RESC1608X55N]
R14  10k  [RESC1005X40N]
R15  10k  [RESC1005X40N]
R16  10k  [RESC1005X40N]
R31  10k  [RESC1005X40N]
R32  10k  [RESC1005X40N]

### Ports
INT (out), SCL (bidir), SDA (bidir)

### Nets
GND: C21.2 C25.2 C26.2 C27.2 IC12.4(GND) IC12.5(A2) IC12.6(A1) IC12.7(A0) IC13.4(GND) IC13.5(A2) IC13.6(A1) IC14.1(A0) IC14.2(A1) IC14.3(A2) IC14.8(VSS) IC15.1(A0) IC15.2(A1) IC15.3(A2) IC15.4(VSS) IC15.7(WP) PB1.3 PB1.4
P3V3MP: C21.1 C25.1 C26.1 C27.1 IC12.8(+VS) IC13.7(A0) IC13.8(+VS) IC14.16(VDD) IC15.8(VCC) LDx.2(A) LDy.2(A) LED17.2(A) R14.1 R15.1 R16.1 R31.1 R32.1
P2: IC14.12(IO7) R7.1
P2_BLUE: LDy.1(C) R7.2
P3: IC14.11(IO6) R8.1
P3_GREEN: LDx.1(C) R8.2
P4: IC14.10(IO5) R9.1
P4_RED: LED17.1(C) R9.2
RTM_IO0: IC14.13(~{INT}) R15.2 ; port INT
NetIC12_1: IC12.1(SDA) IC13.1(SDA) IC14.15(SDA) IC15.5(SDA) R32.2 ; port SDA
NetIC12_2: IC12.2(SCL) IC13.2(SCL) IC14.14(SCL) IC15.6(SCL) R31.2 ; port SCL
NetIC12_3: IC12.3(O.S.) IC13.3(O.S.) IC14.9(IO4) R14.2
NetIC14_4: IC14.4(IO0) PB1.1 PB1.2 R16.2

Not connected (* = marked no-connect by the designer): IC14 5(IO1)* 6(IO2)* 7(IO3)*

### Notes on the sheet
- brakuje PU do I2C
  Using I2C communication OC signals in the user zone are assumed to be terminated on the µRTM side.
- Dodane PU.
  Rezystor R15 podpiêty bezpoœrednio do P3V3MP
- 24LC64T A6-A3 = 1010
  PCA9554 A6-A3 = 0100
  LM75      A6-A3 =  1001
- Project/Equipment
- Document
- uTCA RTM 8 SFP+
- Designer
- Drawn by
- Check.by
- Copyright Creotech Instruments SA 2014.
  This documentation describes Open Hardware and is licensed under the CERN OHL v.1.1. You may redistribute and modify this documentation under the terms of the CERN OHL v.1.1. (http://ohwr.org/CERNOHL). This documentation is distributed WITHOUT ANY EXPRESS OR IMPLIED WARRANTY, INCLUDING OF MERCHANTABILITY, SATISFACTORY QUALITY AND FITNESS FOR A PARTICULAR PURPOSE. Please see the CERN OHL v.1.1 for applicable conditions.
- Creotech Instruments S.A.
- File
- Last Mod.
- Print Date
- Sheet
- Size
- A3
- of
- Rev
- (in symbol LM75AIM/NOPB) °C
- (in symbol R0402_10K_1%_0.0625W_100PPM) 1%
- (in symbol R0603_330R_1%_0.1W_100PPM) 1%
- (in symbol SW_C&K_HDT0001) 1,2; 3,4
- (in symbol LED_AVAGO_HSME-C120) Green

### Library data of the parts
C21 C25-C27 = CC0402_100NF_16V_10%_X7R: as C1 on sheet Serial_Registers; Part Number: CC0402_100NF_16V_10%_X7R; Component Kind: Standard; Component Type: Standard; Pin Count: 2; Value: 100nF; Status: Not Recommended; Manufacturer Part Number: CC0402_100NF_16V_10%_X7R; Case: 0402; Mounted: Yes; Socket: No; SMD: Yes; Manufacturer1 Example: PHYCOMP; Manufacturer1 ComponentHeight: 0.55mm; HelpURL: \\cern.ch\dfs\Applications\Altium\Datasheets\CC0402_X7R_PHYCOMP.pdf; Author: CERN DEM JLC; CreateDate: 12/3/2007; LatestRevisionDate: 12/3/2007
IC12 IC13 = LM75AIM/NOPB: Digital Temperature Sensor and Thermal Watchdog with Two-Wire Interface; Part Description: -25° to +100°C ±2°C Digital Temperature Sensor and Thermal Watchdog with Two-Wire Interface; Manufacturer: TEXAS INSTRUMENTS; PressFit: No; Bonding: No; Part Number: LM75AIM/NOPB; Component Kind: Standard; Component Type: Standard; Device: LM75AIM/NOPB; PackageDescription: SOIC 8, Pitch 1.27mm - Body 4x5mm, IPC Medium Density; Manufacturer Part Number: LM75AIM/NOPB; Pin Count: 8; Case: SOIC8; Mounted: Yes; Socket: No; SMD: Yes; Sense: No; ComponentHeight: 1.75mm; HelpURL: \\cern.ch\dfs\Applications\Altium\Datasheets\LM75AIM-NOPB.pdf; Author: CERN DEM JLC; CreateDate: 15/10/2012; LatestRevisionDate: 15/10/2012
IC14 = PCA9554PW: 8-Bit I2C-Bus and SMBus I/O Port with Interrupt; Manufacturer: NXP SEMICONDUCTORS; PressFit: No; Bonding: No; Part Number: PCA9554PW; Component Kind: Standard; Component Type: Standard; Device: PCA9554PW; PackageDescription: SOP, 0.65mm pitch; 16 pin, 4.40mm W X 5.00mm L X 1.10mm H body IPC Medium Density; Part Description: 8-Bit I2C-Bus and SMBus I/O Port with Interrupt; Manufacturer Part Number: PCA9554PW; Pin Count: 16; Case: TSSOP16; Mounted: Yes; Socket: No; SMD: Yes; Sense: No; ComponentHeight: 1.1mm; Author: CERN DEM JLC; HelpURL: \\cern.ch\dfs\Applications\Altium\Datasheets\PCA9554PW.pdf; CreateDate: 04/11/2014; LatestRevisionDate: 04/11/2014
IC15 = 24LC64-I/MS: 64K I2C Serial EEPROM; Part Description: 2.5V-5.5V, 64K (8K x 8-bit) I2C Serial EEPROM; Manufacturer: MICROCHIP TECHNOLOGY; Table: Logic; Part Number: 24LC64-I/MS; Component Kind: Standard; Component Type: Standard; Device: 24LC64-I/MS; PackageDescription: SOP, 0.65mm pitch; 8 pin, 3.00mm W X 3.00mm L X 1.10mm H body, IPC Medium Density; Manufacturer Part Number: 24LC64-I/MS; Pin Count: 8; Case: MSOP8; Mounted: Yes; Socket: No; SMD: Yes; ComponentHeight: 1.1mm; HelpURL: \\cern.ch\dfs\Applications\Altium\Datasheets\24LC64-I-MS.pdf; Author: CERN DEM JLC; CreateDate: 2011-01-24; LatestRevisionDate: 2011-01-24
LDx = LED_AVAGO_HSME-C120: as LD1 on sheet SFP; Part Number: LED_AVAGO_HSME-C120; Component Kind: Standard; Component Type: Standard; Color: Green; PackageDescription: Green Chip LED, 2-Leads, Body 1.7x1.1mm, Side Emitting Package; Manufacturer Part Number: HSME-C120; Pin Count: 2; Mounted: Yes; Socket: No; SMD: Yes; Sense: No; ComponentHeight: 0.7mm; HelpURL: \\cern.ch\dfs\Applications\Altium\Datasheets\LED_AVAGO_HSME-C120.pdf; ComponentLink1URL: \\cern.ch\dfs\Applications\Altium\Datasheets\LED_AVAGO_HSME-C110_DESIGN-GUIDE.pdf; ComponentLink1Description: Design Guide; Author: CERN DEM JMW; CreateDate: 22/07/2009; LatestRevisionDate: 20/06/2012
LDy = LED_AVAGO_HSMR-C120: LED Blue 1C 2A; Part Description: High Performance Right Angle Chip InGaN Blue LED; Manufacturer: AVAGO TECHNOLOGIES; PressFit: No; Bonding: No; Part Number: LED_AVAGO_HSMR-C120; Component Kind: Standard; Component Type: Standard; Color: Blue; Footprint: LED_AVAGO_HSME-C120; PackageDescription: Blue Chip LED, 2-Leads, Body 1.7x1.1mm, Side Emitting Package; Manufacturer Part Number: HSMR-C120; Pin Count: 2; Mounted: Yes; Socket: No; SMD: Yes; Sense: No; ComponentHeight: 0.7mm; HelpURL: \\cern.ch\dfs\Applications\Altium\Datasheets\LED_AVAGO_HSMR-C120.pdf; Author: CERN DEM JLC; CreateDate: 07/07/2014; LatestRevisionDate: 07/07/2014
LED17 = LED_ROHM_SML-311UTT86K: LED Red 1C 2A; Part Description: Low current chip LED SML-311 Serie; Manufacturer: ROHM; PressFit: No; Bonding: No; Part Number: LED_ROHM_SML-311UTT86K; Component Kind: Standard; Component Type: Standard; Color: Red; PackageDescription: Chip Red LED, 2-Leads, Body 1.6x0.8mm, IPC Medium Density; Manufacturer Part Number: SML-311UTT86K; Pin Count: 2; Mounted: Yes; Socket: No; SMD: Yes; Sense: No; ComponentHeight: 0.8mm; HelpURL: \\cern.ch\dfs\Applications\Altium\Datasheets\LED_ROHM_SML-311UTT86K.pdf; Author: CERN DEM JLC; CreateDate: 16/03/2010; LatestRevisionDate: 17/03/2010
PB1 = SW_C&K_HDT0001: Push-Button Switch SPDT; Part Description: 5VDC 1mA SPST-NO Micro Mini Surface Surface Mount Detect Push-Button Switch, HDT Serie; Manufacturer: C&K; Table: Switches; Part Number: SW_C&K_HDT0001; Component Kind: Standard; Component Type: Standard; Pin Count: 4; PackageDescription: Body 3.5x2.8mm, Micro Mini Surface Mount Detect Switches, HDT Serie; Family: Push Button; Mounted: Yes; Socket: No; SMD: Yes; Status: None; Manufacturer Part Number: HDT0001; ComponentHeight: 3.35mm; HelpURL: \\cern.ch\dfs\Applications\Altium\Datasheets\SW_C&K_HDT0001.pdf; Author: CERN DEM JLC; CreateDate: 2012-08-15; LatestRevisionDate: 2012-08-15
R7-R9 = R0603_330R_1%_0.1W_100PPM: as R1 on sheet SFP; Part Number: R0603_330R_1%_0.1W_100PPM; Component Kind: Standard; Component Type: Standard; Pin Count: 2; Value: 330; Status: Preferred; Tolerance: ±1%; Manufacturer Part Number: R0603_330R_1%_0.1W_100PPM; Case: 0603; Mounted: Yes; Socket: No; SMD: Yes; Manufacturer1 Example: NIC COMPONENT; Manufacturer1 ComponentHeight: 0.55mm; HelpURL: \\cern.ch\dfs\Applications\Altium\Datasheets\R0603_NIC_NRC.pdf; Author: CERN DEM JLC; CreateDate: 2007-12-03; LatestRevisionDate: 2008-03-13
R14-R16 R31 R32 = R0402_10K_1%_0.0625W_100PPM: Resistor - 1%; Part Description: General Purpose Thick Film Chip Resistor; Manufacturer: GENERIC; Manufacturer1 Part Number: 232270671003L; TC: ±100ppm/°C; Table: Resistors SMD; Part Number: R0402_10K_1%_0.0625W_100PPM; Component Kind: Standard; Component Type: Standard; Pin Count: 2; Value: 10k; Status: Not recommended; Power: 0.0625W; Tolerance: ±1%; Manufacturer Part Number: R0402_10K_1%_0.0625W_100PPM; Case: 0402; Mounted: Yes; Socket: No; SMD: Yes; Manufacturer1 Example: YAGEO PHYCOMP; Manufacturer1 ComponentHeight: 0.4mm; HelpURL: \\cern.ch\dfs\Applications\Altium\Datasheets\R0402_Phycomp_RC0402.pdf; Author: CERN DEM JLC; CreateDate: 2007-12-03; LatestRevisionDate: 2012-10-17

## Nets that join several sheets
GND: Clock_Distribution (17 pins), I2C_Switch (6 pins), PWR (28 pins), RTM_Connectors (74 pins), Serial_Registers (30 pins), SFP (18 pins), USR_IO_IPMI (22 pins)
P2V5: Clock_Distribution (L20.1), PWR (9 pins), RTM_Connectors (L4.2)
P3V3: Clock_Distribution (L19.1), I2C_Switch (23 pins), PWR (9 pins), RTM_Connectors (7 pins), Serial_Registers (20 pins), SFP (11 pins)
P3V3MP: RTM_Connectors (J6.c2), USR_IO_IPMI (17 pins)
P12V: PWR (12 pins), RTM_Connectors (F1.2)
FPGA_CLK1_N: Clock_Distribution (IC11.37), RTM_Connectors (J2.b5)
FPGA_CLK1_P: Clock_Distribution (IC11.36), RTM_Connectors (J2.a5)
FPGA_CLK2_N: Clock_Distribution (IC11.39), RTM_Connectors (J2.b9)
FPGA_CLK2_P: Clock_Distribution (IC11.38), RTM_Connectors (J2.a9)
NetIC12_1: Clock_Distribution (OSC1.7), RTM_Connectors (J6.d1), USR_IO_IPMI (5 pins)
NetIC12_2: Clock_Distribution (OSC1.8), RTM_Connectors (J6.d2), USR_IO_IPMI (5 pins)
NetIC17_1: I2C_Switch (IC39.19 R325.1), RTM_Connectors (IC17.1)
NetIC17_8: I2C_Switch (IC39.20 R324.1), RTM_Connectors (IC17.8)
RTM_IO0: RTM_Connectors (J6.c5), USR_IO_IPMI (IC14.13 R15.2)
RTM_IO1: RTM_Connectors (J6.c6), Serial_Registers (R6.1)
RTM_IO2: RTM_Connectors (J6.c7), Serial_Registers (IC1.11 R5.2)
RTM_IO3: RTM_Connectors (J6.c8), Serial_Registers (IC1.3 R13.2)
RTM_IO4: RTM_Connectors (J6.c9), Serial_Registers (IC1.9 R2.2)
RTM_IO5: RTM_Connectors (J6.c10), Serial_Registers (IC1.5 R3.2)
RTM_IO6: RTM_Connectors (J2.a1), Serial_Registers (IC1.1 R4.2)
RTM_IO8: Clock_Distribution (R391.2), RTM_Connectors (J2.c1)
RTM_IO9: Clock_Distribution (OSC1.2 R311.1), RTM_Connectors (J2.c2)
SYNC_CLK_N: Clock_Distribution (C395.2), RTM_Connectors (J6.d3)
SYNC_CLK_P: Clock_Distribution (C394.2), RTM_Connectors (J6.c3)

## Assembly variants
White Rabbit Copper SFP: not fitted L4 R107A R107B R107C R107D R107E R107F R107G R107H
Optical Output: not fitted C202A C202B C202C C202D C202E C202F C202G C202H IC20A IC20B IC20C IC20D IC20E IC20F IC20G IC20H L4 R105A R105B R105C R105D R105E R105F R105G R105H R109A R109B R109C R109D R109E R109F R109G R109H